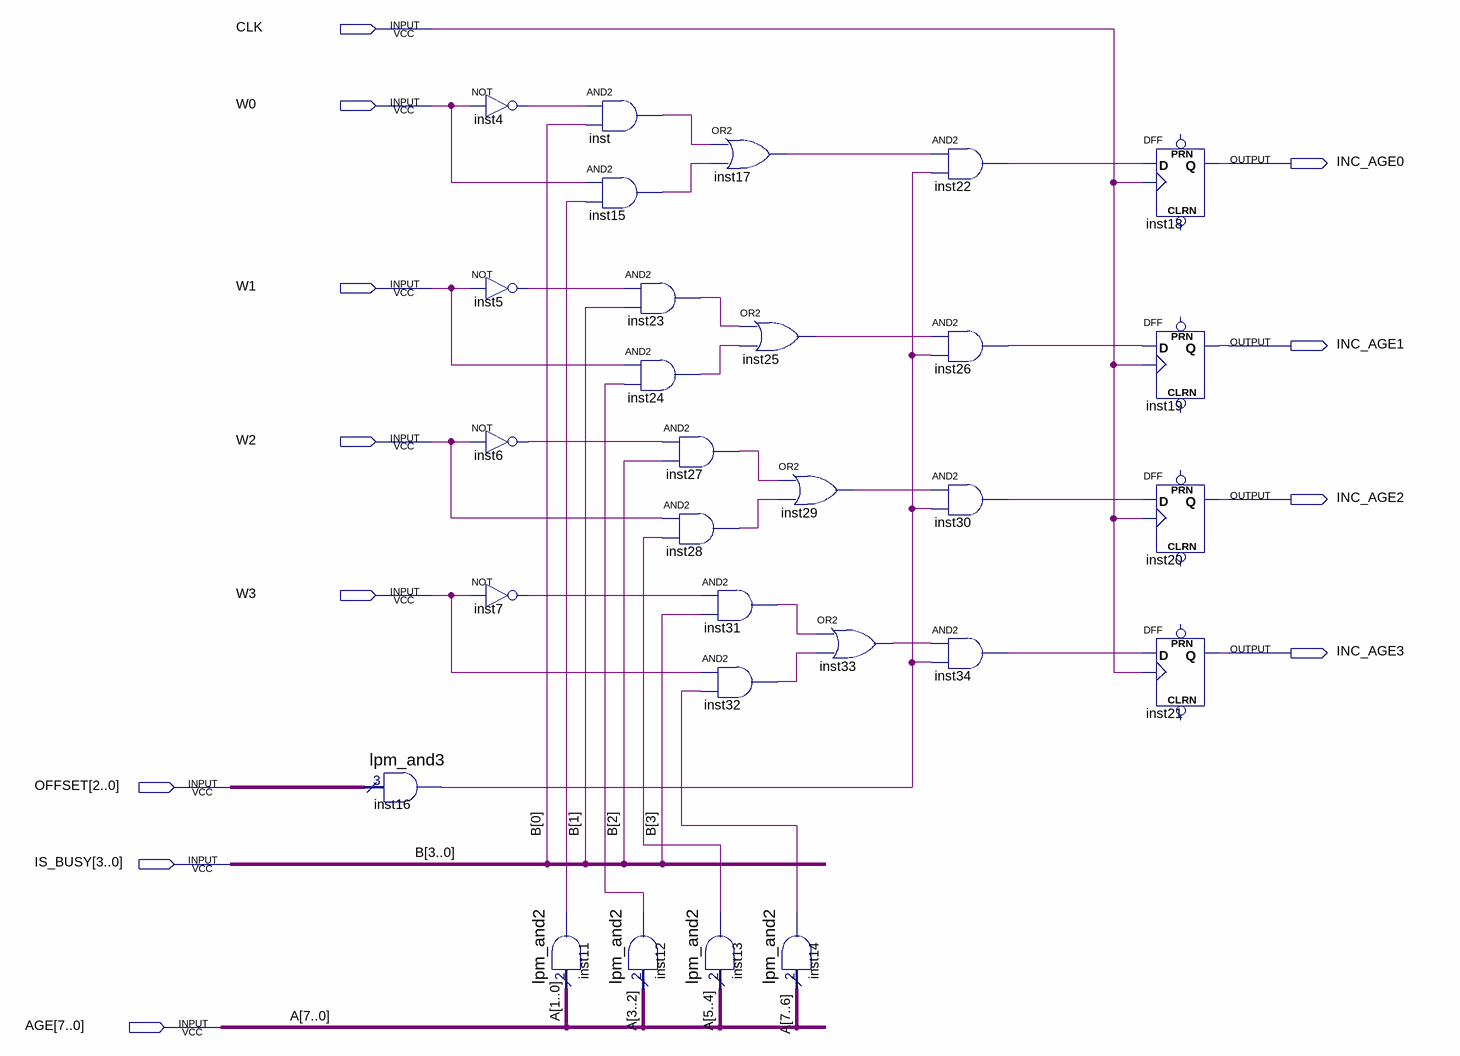
[diagram p0: schematic sheet]
// Quartus schematic INC_AGE.bdf as structural Verilog: 29 symbols, 12 pins
module INC_AGE (
  input  CLK,
  input  W0,
  input  W1,
  input  W2,
  input  W3,
  input  [2:0] OFFSET,
  input  [3:0] IS_BUSY,
  input  [7:0] AGE,
  output INC_AGE0,
  output INC_AGE1,
  output INC_AGE2,
  output INC_AGE3
);

  wire inst4_out, inst5_out, inst6_out, inst7_out, inst11_result, inst12_result, inst13_result,
       inst14_result, inst15_out, inst16_result, inst17_out, inst22_out, inst23_out, inst24_out, inst25_out,
       inst26_out, inst27_out, inst28_out, inst29_out, inst30_out, inst31_out, inst32_out, inst33_out,
       inst34_out, inst_out;

  lpm_and3 inst16 (.data(OFFSET), .result(inst16_result));
  not inst4 (inst4_out, W0);
  not inst5 (inst5_out, W1);
  not inst6 (inst6_out, W2);
  not inst7 (inst7_out, W3);
  lpm_and2 inst11 (.data(AGE[1:0]), .result(inst11_result));
  and inst (inst_out, inst4_out, IS_BUSY[0]);
  and inst15 (inst15_out, W0, inst11_result);
  and inst23 (inst23_out, inst5_out, IS_BUSY[1]);
  and inst24 (inst24_out, W1, inst12_result);
  lpm_and2 inst12 (.data(AGE[3:2]), .result(inst12_result));
  or inst17 (inst17_out, inst_out, inst15_out);
  and inst27 (inst27_out, inst6_out, IS_BUSY[2]);
  and inst28 (inst28_out, W2, inst13_result);
  and inst31 (inst31_out, inst7_out, IS_BUSY[3]);
  and inst32 (inst32_out, W3, inst14_result);
  lpm_and2 inst13 (.data(AGE[5:4]), .result(inst13_result));
  or inst25 (inst25_out, inst23_out, inst24_out);
  or inst29 (inst29_out, inst27_out, inst28_out);
  lpm_and2 inst14 (.data(AGE[7:6]), .result(inst14_result));
  or inst33 (inst33_out, inst31_out, inst32_out);
  and inst22 (inst22_out, inst17_out, inst16_result);
  and inst26 (inst26_out, inst25_out, inst16_result);
  and inst30 (inst30_out, inst29_out, inst16_result);
  and inst34 (inst34_out, inst33_out, inst16_result);
  DFF inst18 (.CLK(CLK), .D(inst22_out), .Q(INC_AGE0));  // open: CLRN, PRN
  DFF inst19 (.CLK(CLK), .D(inst26_out), .Q(INC_AGE1));  // open: CLRN, PRN
  DFF inst20 (.CLK(CLK), .D(inst30_out), .Q(INC_AGE2));  // open: CLRN, PRN
  DFF inst21 (.CLK(CLK), .D(inst34_out), .Q(INC_AGE3));  // open: CLRN, PRN

  // Other names for the same wires on the sheet: A[7:0] = AGE; B[3:0] = IS_BUSY
endmodule
